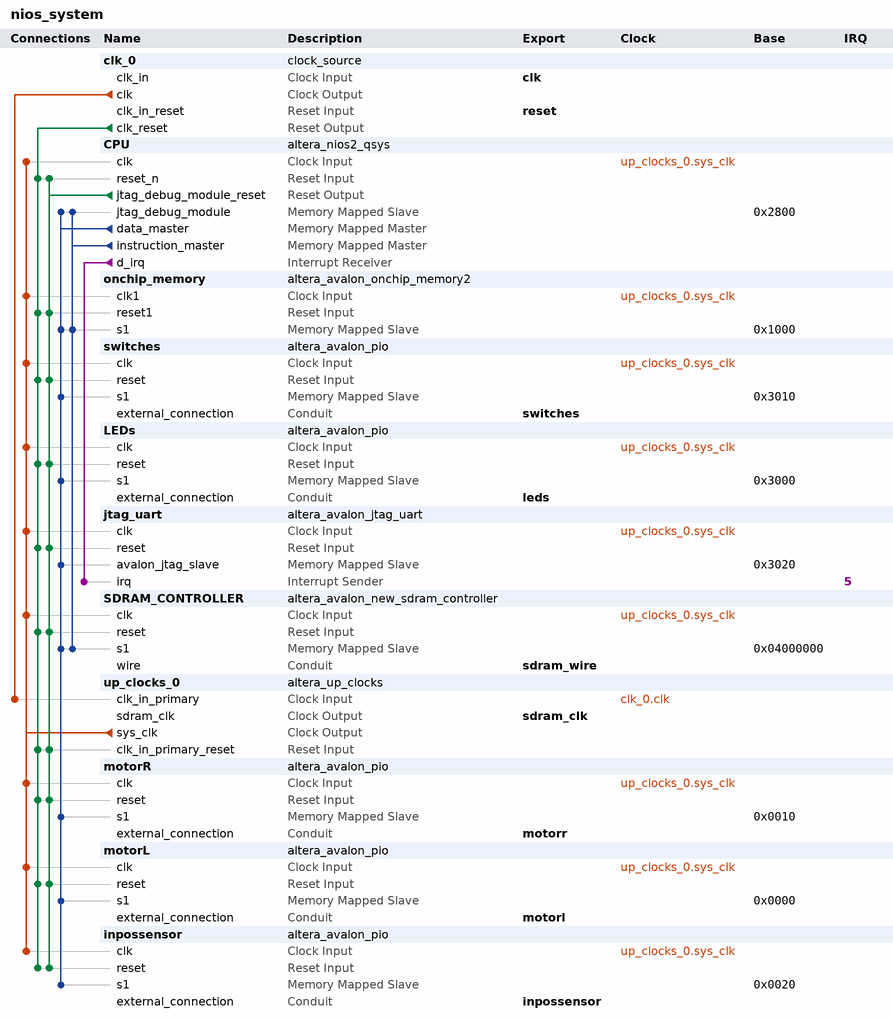
[diagram p0: system contents]
# Platform Designer (Qsys) system nios_system, Cyclone IV E Unknown
# Parameters at their usual value, and those the tool derives, are not listed.
package require -exact qsys 13.0.1.99.2
create_system nios_system
set_project_property DEVICE_FAMILY {Cyclone IV E}
set_project_property DEVICE Unknown

add_instance clk_0 clock_source 13.0
set_instance_parameter_value clk_0 clockFrequency 50000000

add_instance CPU altera_nios2_qsys 13.0
set_instance_parameter_value CPU resetSlave SDRAM_CONTROLLER.s1
set_instance_parameter_value CPU mmu_TLBMissExcSlave None
set_instance_parameter_value CPU exceptionSlave SDRAM_CONTROLLER.s1
set_instance_parameter_value CPU breakSlave CPU.jtag_debug_module
set_instance_parameter_value CPU impl Tiny
set_instance_parameter_value CPU icache_size 4096

add_instance onchip_memory altera_avalon_onchip_memory2 13.0.1.99.2
set_instance_parameter_value onchip_memory dataWidth 32
set_instance_parameter_value onchip_memory dualPort false
set_instance_parameter_value onchip_memory initMemContent true
set_instance_parameter_value onchip_memory initializationFileName onchip_mem.hex
set_instance_parameter_value onchip_memory memorySize 4096

add_instance switches altera_avalon_pio 13.0.1.99.2
set_instance_parameter_value switches direction Input
set_instance_parameter_value switches width 8

add_instance LEDs altera_avalon_pio 13.0.1.99.2
set_instance_parameter_value LEDs direction Output
set_instance_parameter_value LEDs width 8

add_instance jtag_uart altera_avalon_jtag_uart 13.0.1.99.2
set_instance_parameter_value jtag_uart simInteractiveOptions NO_INTERACTIVE_WINDOWS

add_instance SDRAM_CONTROLLER altera_avalon_new_sdram_controller 13.0.1.99.2
set_instance_parameter_value SDRAM_CONTROLLER TAC 5.5
set_instance_parameter_value SDRAM_CONTROLLER TRCD 20.0
set_instance_parameter_value SDRAM_CONTROLLER TRP 20.0
set_instance_parameter_value SDRAM_CONTROLLER casLatency 3
set_instance_parameter_value SDRAM_CONTROLLER columnWidth 9
set_instance_parameter_value SDRAM_CONTROLLER dataWidth 16
set_instance_parameter_value SDRAM_CONTROLLER generateSimulationModel false
set_instance_parameter_value SDRAM_CONTROLLER model single_Micron_MT48LC4M32B2_7_chip
set_instance_parameter_value SDRAM_CONTROLLER numberOfBanks 4
set_instance_parameter_value SDRAM_CONTROLLER numberOfChipSelects 1
set_instance_parameter_value SDRAM_CONTROLLER powerUpDelay 100.0
set_instance_parameter_value SDRAM_CONTROLLER refreshPeriod 15.625
set_instance_parameter_value SDRAM_CONTROLLER rowWidth 13

add_instance up_clocks_0 altera_up_clocks 13.0
set_instance_parameter_value up_clocks_0 board DE0-Nano
set_instance_parameter_value up_clocks_0 vga_clk false
set_instance_parameter_value up_clocks_0 audio_clk true
set_instance_parameter_value up_clocks_0 audio_clk_freq 12.288

add_instance motorR altera_avalon_pio 13.0.1.99.2
set_instance_parameter_value motorR direction Output
set_instance_parameter_value motorR width 16

add_instance motorL altera_avalon_pio 13.0.1.99.2
set_instance_parameter_value motorL direction Output
set_instance_parameter_value motorL width 16

add_instance inpossensor altera_avalon_pio 13.0.1.99.2
set_instance_parameter_value inpossensor direction Input
set_instance_parameter_value inpossensor width 8

# connections
add_connection clk_0.clk up_clocks_0.clk_in_primary clock
add_connection up_clocks_0.sys_clk CPU.clk clock
add_connection up_clocks_0.sys_clk inpossensor.clk clock
add_connection up_clocks_0.sys_clk jtag_uart.clk clock
add_connection up_clocks_0.sys_clk LEDs.clk clock
add_connection up_clocks_0.sys_clk motorL.clk clock
add_connection up_clocks_0.sys_clk motorR.clk clock
add_connection up_clocks_0.sys_clk onchip_memory.clk1 clock
add_connection up_clocks_0.sys_clk SDRAM_CONTROLLER.clk clock
add_connection up_clocks_0.sys_clk switches.clk clock
add_connection clk_0.clk_reset CPU.reset_n reset
add_connection clk_0.clk_reset inpossensor.reset reset
add_connection clk_0.clk_reset jtag_uart.reset reset
add_connection clk_0.clk_reset LEDs.reset reset
add_connection clk_0.clk_reset motorL.reset reset
add_connection clk_0.clk_reset motorR.reset reset
add_connection clk_0.clk_reset onchip_memory.reset1 reset
add_connection clk_0.clk_reset SDRAM_CONTROLLER.reset reset
add_connection clk_0.clk_reset switches.reset reset
add_connection clk_0.clk_reset up_clocks_0.clk_in_primary_reset reset
add_connection CPU.jtag_debug_module_reset CPU.reset_n reset
add_connection CPU.jtag_debug_module_reset inpossensor.reset reset
add_connection CPU.jtag_debug_module_reset jtag_uart.reset reset
add_connection CPU.jtag_debug_module_reset LEDs.reset reset
add_connection CPU.jtag_debug_module_reset motorL.reset reset
add_connection CPU.jtag_debug_module_reset motorR.reset reset
add_connection CPU.jtag_debug_module_reset onchip_memory.reset1 reset
add_connection CPU.jtag_debug_module_reset SDRAM_CONTROLLER.reset reset
add_connection CPU.jtag_debug_module_reset switches.reset reset
add_connection CPU.jtag_debug_module_reset up_clocks_0.clk_in_primary_reset reset
add_connection CPU.data_master CPU.jtag_debug_module avalon
set_connection_parameter_value CPU.data_master/CPU.jtag_debug_module baseAddress 0x2800
add_connection CPU.data_master inpossensor.s1 avalon
set_connection_parameter_value CPU.data_master/inpossensor.s1 baseAddress 0x0020
add_connection CPU.data_master jtag_uart.avalon_jtag_slave avalon
set_connection_parameter_value CPU.data_master/jtag_uart.avalon_jtag_slave baseAddress 0x3020
add_connection CPU.data_master LEDs.s1 avalon
set_connection_parameter_value CPU.data_master/LEDs.s1 baseAddress 0x3000
add_connection CPU.data_master motorL.s1 avalon
set_connection_parameter_value CPU.data_master/motorL.s1 baseAddress 0x0000
add_connection CPU.data_master motorR.s1 avalon
set_connection_parameter_value CPU.data_master/motorR.s1 baseAddress 0x0010
add_connection CPU.data_master onchip_memory.s1 avalon
set_connection_parameter_value CPU.data_master/onchip_memory.s1 baseAddress 0x1000
add_connection CPU.data_master SDRAM_CONTROLLER.s1 avalon
set_connection_parameter_value CPU.data_master/SDRAM_CONTROLLER.s1 baseAddress 0x04000000
add_connection CPU.data_master switches.s1 avalon
set_connection_parameter_value CPU.data_master/switches.s1 baseAddress 0x3010
add_connection CPU.instruction_master CPU.jtag_debug_module avalon
set_connection_parameter_value CPU.instruction_master/CPU.jtag_debug_module baseAddress 0x2800
add_connection CPU.instruction_master onchip_memory.s1 avalon
set_connection_parameter_value CPU.instruction_master/onchip_memory.s1 baseAddress 0x1000
add_connection CPU.instruction_master SDRAM_CONTROLLER.s1 avalon
set_connection_parameter_value CPU.instruction_master/SDRAM_CONTROLLER.s1 baseAddress 0x04000000
add_connection CPU.d_irq jtag_uart.irq interrupt
set_connection_parameter_value CPU.d_irq/jtag_uart.irq irqNumber 5

# exported interfaces
add_interface reset reset sink
set_interface_property reset EXPORT_OF clk_0.clk_in_reset
add_interface switches conduit end
set_interface_property switches EXPORT_OF switches.external_connection
add_interface leds conduit end
set_interface_property leds EXPORT_OF LEDs.external_connection
add_interface clk clock sink
set_interface_property clk EXPORT_OF clk_0.clk_in
add_interface sdram_wire conduit end
set_interface_property sdram_wire EXPORT_OF SDRAM_CONTROLLER.wire
add_interface motorr conduit end
set_interface_property motorr EXPORT_OF motorR.external_connection
add_interface motorl conduit end
set_interface_property motorl EXPORT_OF motorL.external_connection
add_interface inpossensor conduit end
set_interface_property inpossensor EXPORT_OF inpossensor.external_connection
add_interface sdram_clk clock source
set_interface_property sdram_clk EXPORT_OF up_clocks_0.sdram_clk

set_interconnect_requirement {$system} qsys_mm.clockCrossingAdapter HANDSHAKE
set_interconnect_requirement {$system} qsys_mm.maxAdditionalLatency 1

save_system nios_system.qsys
